# Altium schematic sheet Sheet1.SchDoc
size A4
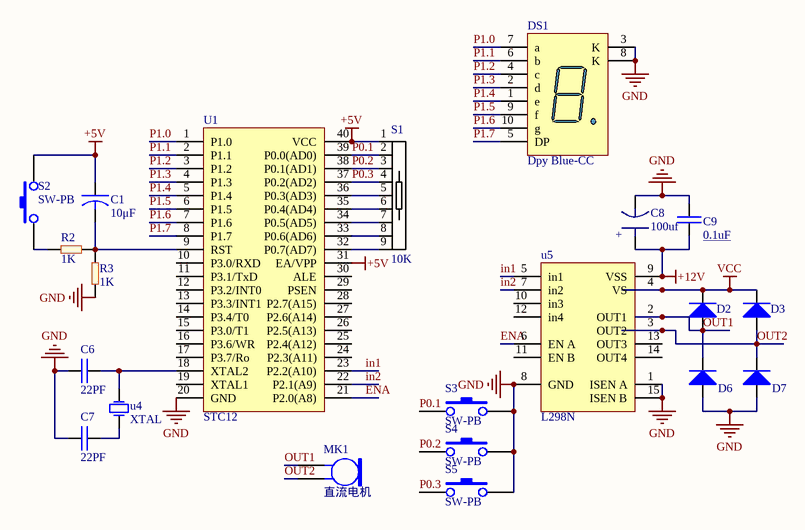
[diagram p0: Sheet1.SchDoc]

## Parts
C1  10μF  [电解电容]
C6  22PF  [瓷片电容]
C7  22PF  [瓷片电容]
C8  100uf  [电解电容]
C9  0.1uF  [瓷片电容]
D2  1N4007  [二极管 直插]  (value not drawn)
D3  1N4007  [二极管 直插]  (value not drawn)
D6  1N4007  [二极管 直插]  (value not drawn)
D7  1N4007  [二极管 直插]  (value not drawn)
DS1  Dpy Blue-CC  [LEDDIP-10/C15.24RHD]
MK1  直流电机  [PIN2]
R2  1K  [电阻]
R3  1K  [电阻]
S1  10K  [SIP9]
S2  SW-PB  [ANJIAN]
S3  SW-PB  [ANJIAN]
S4  SW-PB  [ANJIAN]
S5  SW-PB  [ANJIAN]
U1  STC12  [STC52]
u4  XTAL  [晶振.]
u5  L298N  [L298N]

## Nets
+5V: C1.1 S1.1 S2.2 U1.31(EA/VPP) U1.40(VCC)
+12V: C8.1 C9.1 u5.9(VSS)
GND: C6.1 C7.1 C8.2 C9.2 D6.1 D7.1 DS1.3(K) DS1.8(K) R3.1 S3.2 S4.2 S5.2 U1.20(GND) u5.1(ISEN_A) u5.8(GND) u5.15(ISEN_B)
VCC: D2.2 D3.2 u5.4(VS)
ENA: U1.21(P2.0(A8)) u5.6(EN_A)
in1: U1.23(P2.2(A10)) u5.5(in1)
in2: U1.22(P2.1(A9)) u5.7(in2)
OUT1: D2.1 D6.2 MK1.1 u5.2(OUT1)
OUT2: D3.1 D7.2 MK1.2 u5.3(OUT2)
P0.1: S1.2 S3.1 U1.39(P0.0(AD0))
P0.2: S1.3 S4.1 U1.38(P0.1(AD1))
P0.3: S1.4 S5.1 U1.37(P0.2(AD2))
P1.0: DS1.7(a) U1.1(P1.0)
P1.1: DS1.6(b) U1.2(P1.1)
P1.2: DS1.4(c) U1.3(P1.2)
P1.3: DS1.2(d) U1.4(P1.3)
P1.4: DS1.1(e) U1.5(P1.4)
P1.5: DS1.9(f) U1.6(P1.5)
P1.6: DS1.10(g) U1.7(P1.6)
P1.7: DS1.5(DP) U1.8(P1.7)
NetC1_2: C1.2 R2.2 R3.2 U1.9(RST)
NetC6_2: C6.2 U1.18(XTAL2) u4.2(OSC2)
NetC7_2: C7.2 u4.1(OSC1)
NetR2_1: R2.1 S2.1
NetS1_5: S1.5 U1.36(P0.3(AD3))
NetS1_6: S1.6 U1.35(P0.4(AD4))
NetS1_7: S1.7 U1.34(P0.5(AD5))
NetS1_8: S1.8 U1.33(P0.6(AD6))
NetS1_9: S1.9 U1.32(P0.7(AD7))

Not connected (* = marked no-connect by the designer): U1 10(P3.0/RXD) 11(P3.1/TxD) 12(P3.2/INT0) 13(P3.3/INT1) 14(P3.4/T0) 15(P3.0/T1) 16(P3.6/WR) 17(P3.7/Ro) 19(XTAL1) 24(P2.3(A11)) 25(P2.4(A12)) 26(P2.5(A13)) 27(P2.6(A14)) 28(P2.7(A15)) 29(PSEN) 30(ALE); u5 10(in3) 11(EN_B) 12(in4) 13(OUT3) 14(OUT4)

## Notes on the sheet
- (in symbol 电解电容) +

## Library data of the parts
C1 = CAPACITOR
C6 C7 = 瓷片电容
C8 = 电解电容
C9 = 瓷片电容_1
DS1 = Dpy Blue-CC: 14.2 mm General Purpose Blue 7-Segment Display: CC, RH DP, Gray Surface; MinimumIntensity: 2020 ucd; Note: IF = 10 mA; Published: 8-Jun-2000; LatestRevisionDate: 17-Dec-2003; LatestRevisionNote: Schematic revised, PCB Footprint replaced.; DatasheetVersion: 24-Sep-2002; PackageVersion: 24-Sep-2002; PackageReference: H; Publisher: Altium Limited; Colour: Blue; ComponentLink1Description: Manufacturer Link; ComponentLink1URL: http://www.agilent.com/
MK1 = Mic2: Microphone; Published: 24-Mar-1999; LatestRevisionDate: 17-Jul-2002; LatestRevisionNote: Re-released for DXP Platform.; PackageReference: PIN2; Publisher: Altium Limited
R2 R3 = R
S1 = RES-9
U1 = 12单片机
D2 D3 D6 D7 = 1N4007: Published: 8-Jun-2000; LatestRevisionDate: 17-Jul-2002; LatestRevisionNote: Re-released for DXP Platform.; DatasheetDocument: 1998; PackageDocument: Aug-1999; PackageReference: DO-41; Publisher: Altium Limited; Code_JEDEC: DO-204-AL; ComponentLink1Description: Manufacturer Link; ComponentLink1URL: http://www.fairchildsemi.com/; ComponentLink2Description: Datasheet; ComponentLink2URL: http://www.fairchildsemi.com/ds/1N%2F1N4001.pdf